# Altium schematic sheet Shema.SchDoc
size 420 x 297 mm; SheetTotal: 1
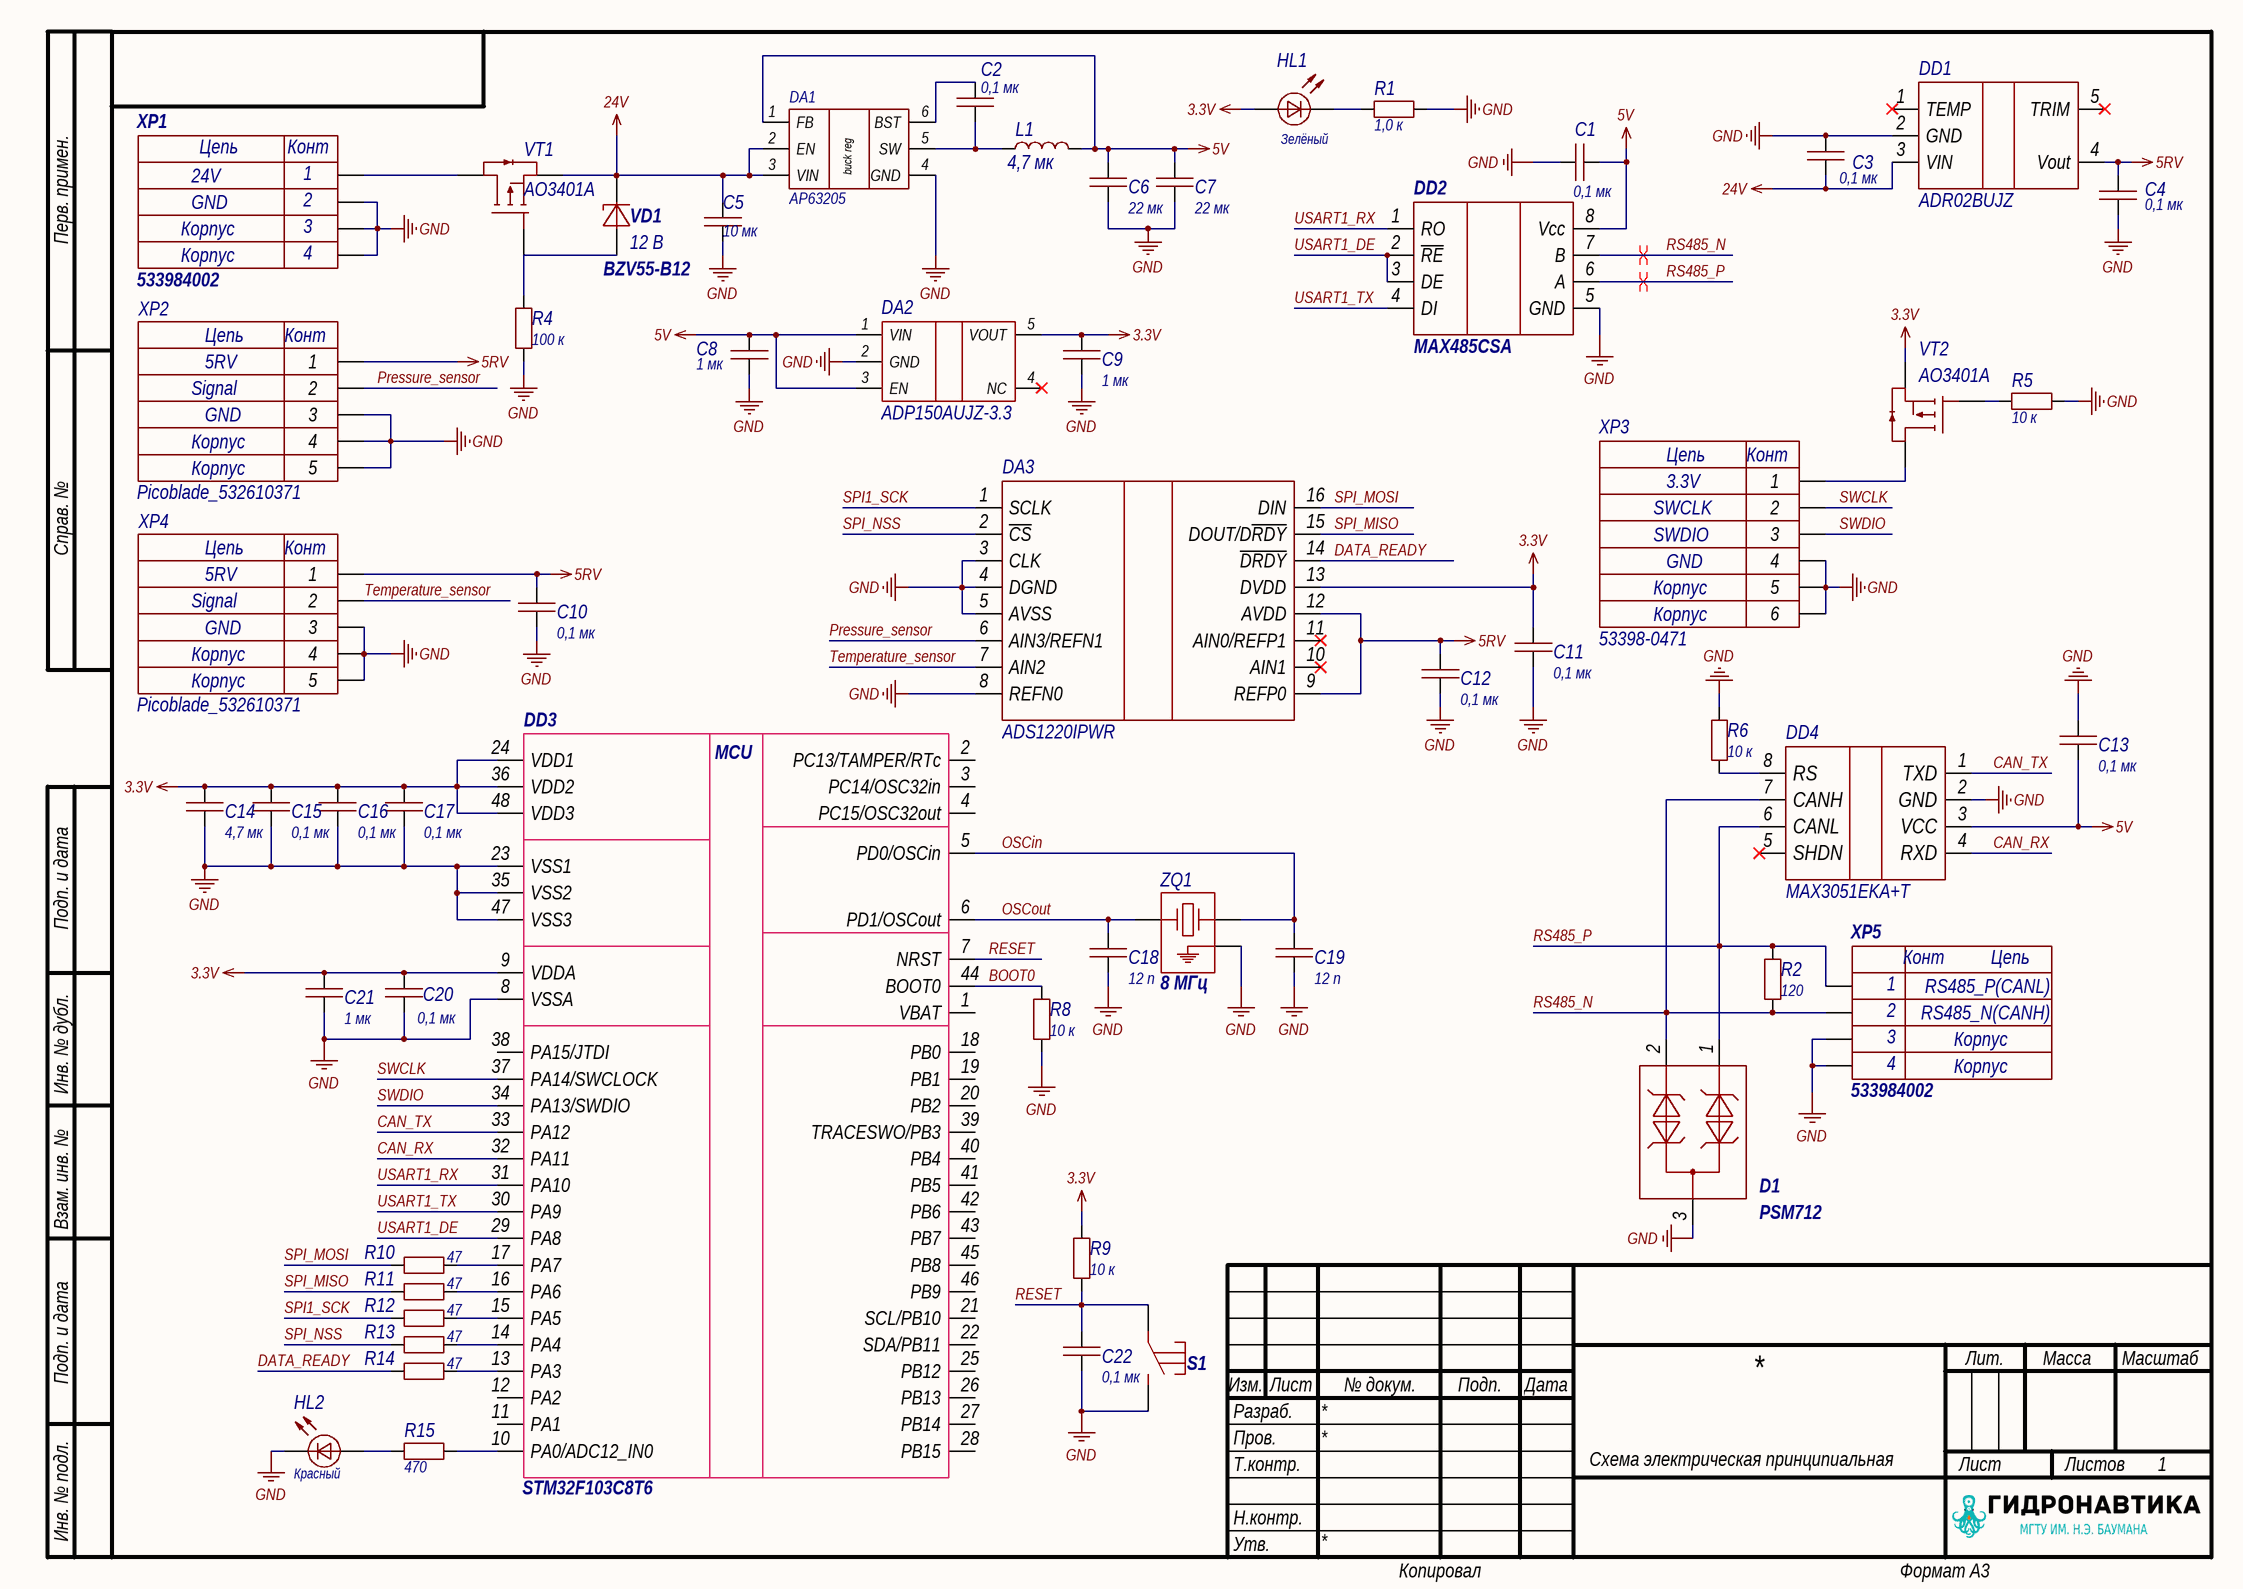
[diagram p0: Shema.SchDoc]

## Parts
C1  value 0,1 мк  [0603C]  (hidden comment: Capacitor)
C2  value 0,1 мк  [0603C]  (hidden comment: Capacitor)
C3  value 0,1 мк  [0603C]  (hidden comment: Capacitor)
C4  value 0,1 мк  [0603C]  (hidden comment: Capacitor)
C5  value 10 мк  [1210C]  (hidden comment: Capacitor)
C6  value 22 мк  [1210C]  (hidden comment: Capacitor)
C7  value 22 мк  [1210C]  (hidden comment: Capacitor)
C8  value 1 мк  [0603C]  (hidden comment: Capacitor)
C9  value 1 мк  [0603C]  (hidden comment: Capacitor)
C10  value 0,1 мк  [0603C]  (hidden comment: Capacitor)
C11  value 0,1 мк  [0603C]  (hidden comment: Capacitor)
C12  value 0,1 мк  [0603C]  (hidden comment: Capacitor)
C13  value 0,1 мк  [0603C]  (hidden comment: Capacitor)
C14  value 4,7 мк  [1206C]  (hidden comment: Capacitor)
C15  value 0,1 мк  [0603C]  (hidden comment: Capacitor)
C16  value 0,1 мк  [0603C]  (hidden comment: Capacitor)
C17  value 0,1 мк  [0603C]  (hidden comment: Capacitor)
C18  value 12 п  [0603C]  (hidden comment: Capacitor)
C19  value 12 п  [0603C]  (hidden comment: Capacitor)
C20  value 0,1 мк  [0603C]  (hidden comment: Capacitor)
C21  value 1 мк  [0603C]  (hidden comment: Capacitor)
C22  value 0,1 мк  [0603C]  (hidden comment: Capacitor)
D1  PSM712  [SOT23-3]
DA1  AP63205  [TSOT26]
DA2  ADP150AUJZ-3.3  [SOT23-5]
DA3  ADS1220IPWR  [TSSOP-16]
DD1  ADR02BUJZ  [SOT23-5]
DD2  MAX485CSA  [SOIC-8]
DD3  STM32F103C8T6  Value1: MCU  [LQFP48]
DD4  MAX3051EKA+T  [SOT-23-8]
HL1  value Зелёный  [0805D]  (hidden comment: LED)
HL2  value Красный  [0805D]  (hidden comment: LED)
L1  value 4,7 мк  [IHLP-2525]  (hidden comment: IHLP2525CZER4R7M01)
R1  value 1,0 к  [0603R]  (hidden comment: Resistor)
R2  value 120  [1206R]  (hidden comment: Resistor)
R4  value 100 к  [0603R]  (hidden comment: Resistor)
R5  value 10 к  [0603R]  (hidden comment: Resistor)
R6  value 10 к  [0603R]  (hidden comment: Resistor)
R8  value 10 к  [0603R]  (hidden comment: Resistor)
R9  value 10 к  [0603R]  (hidden comment: Resistor)
R10  value 47  [0603R]  (hidden comment: Resistor)
R11  value 47  [0603R]  (hidden comment: Resistor)
R12  value 47  [0603R]  (hidden comment: Resistor)
R13  value 47  [0603R]  (hidden comment: Resistor)
R14  value 47  [0603R]  (hidden comment: Resistor)
R15  value 470  [0603R]  (hidden comment: Resistor)
S1  Tact_button  [Button_SMD_10mm]  (value not drawn)
VD1  BZV55-B12  value 12 В  [mini_MELF_3.5mm]
VT1  AO3401A  [SOT23-3]
VT2  AO3401A  [SOT23-3]
XP1  533984002  Value3: Корпус  Value2: GND  Value1: 24V  [Picoblade_533984002]
XP2  Picoblade_532610371  Value5: Корпус  Value3: GND  Value2: Signal  Value1: 5RV  [CONN_532610001-SD_03_MOL]
XP3  53398-0471  Value6: Корпус  Value4: GND  Value3: SWDIO  Value2: SWCLK  Value1: 3.3V  [53398-0471]
XP4  Picoblade_532610371  Value5: Корпус  Value3: GND  Value2: Signal  Value1: 5RV  [CONN_532610001-SD_03_MOL]
XP5  533984002  Value3: Корпус  Value2: RS485_N(CANH)  Value1: RS485_P(CANL)  [Picoblade_533984002]
ZQ1  value 8 МГц  [QSMD3.2x2.5]  (hidden comment: XTAL_GND)

## Nets
3.3V: C9.2 C11.2 C14.2 C15.2 C16.2 C17.2 C20.2 C21.2 DA2.5(VOUT) DA3.13(DVDD) DD3.9(VDDA) DD3.24(VDD1) DD3.36(VDD2) DD3.48(VDD3) HL1.1 R9.1 VT2.2
5RV: C4.2 C10.2 C12.2 DA3.9(REFP0) DA3.12(AVDD) DD1.4(Vout) XP2.1 XP4.1
5V: C1.2 C6.2 C7.2 C8.2 C13.2 DA1.1(FB) DA2.1(VIN) DA2.3(EN) DD2.8(Vcc) DD4.3(VCC) L1.2
24V: C3.1 C5.2 DA1.2(EN) DA1.3(VIN) DD1.3(VIN) VD1.2 VT1.2
GND: C1.1 C3.2 C4.1 C5.1 C6.1 C7.1 C8.1 C9.1 C10.1 C11.1 C12.1 C13.1 C14.1 C15.1 C16.1 C17.1 C18.1 C19.1 C20.1 C21.1 C22.2 D1.3 DA1.4(GND) DA2.2(GND) DA3.3(CLK) DA3.4(DGND) DA3.5(AVSS) DA3.8(REFN0) DD1.2(GND) DD2.5(GND) DD3.8(VSSA) DD3.23(VSS1) DD3.35(VSS2) DD3.47(VSS3) DD4.2(GND) HL2.2 R1.2 R4.1 R5.2 R6.2 R8.2 S1.2 XP1.2 XP1.3 XP1.4 XP2.3 XP2.4 XP2.5 XP3.4 XP3.5 XP3.6 XP4.3 XP4.4 XP4.5 XP5.3 XP5.4 ZQ1.3
BOOT0: DD3.44(BOOT0) R8.1
CAN_RX: DD3.32(PA11) DD4.4(RXD)
CAN_TX: DD3.33(PA12) DD4.1(TXD)
DATA_READY: DA3.14(~{DRDY}) R14.1
OSCin: C19.2 DD3.5(PD0/OSCin) ZQ1.2
OSCout: C18.2 DD3.6(PD1/OSCout) ZQ1.1
Pressure_sensor: DA3.6(AIN3/REFN1) XP2.2
RESET: C22.1 DD3.7(NRST) R9.2 S1.1
RS485_N: D1.2 DD2.7(B) DD4.7(CANH) R2.1 XP5.2
RS485_P: D1.1 DD2.6(A) DD4.6(CANL) R2.2 XP5.1
SPI1_SCK: DA3.1(SCLK) R12.1
SPI_MISO: DA3.15(DOUT/D~{RDY}) R11.1
SPI_MOSI: DA3.16(DIN) R10.1
SPI_NSS: DA3.2(~{CS}) R13.1
SWCLK: DD3.37(PA14/SWCLOCK) XP3.2
SWDIO: DD3.34(PA13/SWDIO) XP3.3
Temperature_sensor: DA3.7(AIN2) XP4.2
USART1_DE: DD2.2(~{RE}) DD2.3(DE) DD3.29(PA8)
USART1_RX: DD2.1(RO) DD3.31(PA10)
USART1_TX: DD2.4(DI) DD3.30(PA9)
NetC2_1: C2.1 DA1.5(SW) L1.1
NetC2_2: C2.2 DA1.6(BST)
NetDD3_10: DD3.10(PA0/ADC12_IN0) R15.2
NetDD3_13: DD3.13(PA3) R14.2
NetDD3_14: DD3.14(PA4) R13.2
NetDD3_15: DD3.15(PA5) R12.2
NetDD3_16: DD3.16(PA6) R11.2
NetDD3_17: DD3.17(PA7) R10.2
NetDD4_8: DD4.8(RS) R6.1
NetHL1_2: HL1.2 R1.1
NetHL2_1: HL2.1 R15.1
NetR4_2: R4.2 VD1.1 VT1.1
NetR5_1: R5.1 VT2.1
NetVT1_3: VT1.3 XP1.1
NetVT2_3: VT2.3 XP3.1

Not connected (* = marked no-connect by the designer): DA2 4(NC)*; DA3 10(AIN1)* 11(AIN0/REFP1)*; DD1 1(TEMP)* 5(TRIM)*; DD3 1(VBAT) 2(PC13/TAMPER/RTc) 3(PC14/OSC32in) 4(PC15/OSC32out) 11(PA1) 12(PA2) 18(PB0) 19(PB1) 20(PB2) 21(SCL/PB10) 22(SDA/PB11) 25(PB12) 26(PB13) 27(PB14) 28(PB15) 38(PA15/JTDI) 39(TRACESWO/PB3) 40(PB4) 41(PB5) 42(PB6) 43(PB7) 45(PB8) 46(PB9); DD4 5(SHDN)*

## Layout directives
differential pair: RS485_N, RS485_P

## Notes on the sheet
- Перв. примен.
- Справ. №
- Подп. и дата
- Инв. № дубл.
- Взам. инв. №
- Разраб.
- Изм.
- Лист
- № докум.
- Подп.
- Дата
- Лит.
- Масса
- Масштаб
- Пров.
- Т.контр.
- Схема электрическая принципиальная
- Листов
- Инв. № подл.
- Утв.
- Н.контр.
- Копировал
- Формат А3
- (in symbol AP63205) buck reg
- (in symbol PicoBlade_53398-0471) Цепь; Конт
- (in symbol Picoblade_532610371) Цепь; Конт
- (in symbol Picoblade_533984002) Цепь; Конт

## Library data of the parts
C1-C4 C10-C13 C15-C17 C20 C22 = Capacitor_0,1u_10_50V_X7R_0603C: Конденсатор 0603C ёмкостью 0,1 мк 10%, 50 В, X7R; Voltage (V): 50; Capacity (nF): 100; Part Number: Capacitor_0,1u_10_50V_X7R_0603C; Tolerance: 10%; Dielectric: X7R
C5 = Capacitor_10u_10_35V_X7R_1210C: Конденсатор 1210C ёмкостью 10 мк 10%, 35 В, X7R; Voltage (V): 35; Capacity (nF): 10000; Part Number: Capacitor_10u_10_35V_X7R_1210C; Tolerance: 10%; Dielectric: X7R
C6 C7 = Capacitor_22u_10_25V_X7R_1210C: Конденсатор 1210C ёмкостью 22 мк 10%, 25 В, X7R; Voltage (V): 25; Capacity (nF): 22000; Part Number: Capacitor_22u_10_25V_X7R_1210C; Tolerance: 10%; Dielectric: X7R
C8 C9 C21 = Capacitor_1u_10_25V_X7R_0603C: Конденсатор 0603C ёмкостью 1 мк 10%, 25 В, X7R; Voltage (V): 25; Capacity (nF): 1000; Part Number: Capacitor_1u_10_25V_X7R_0603C; Tolerance: 10%; Dielectric: X7R
C14 = Capacitor_4,7u_10_50V_X7R_1206C: Конденсатор 1206C ёмкостью 4,7 мк 10%, 50 В, X7R; Voltage (V): 50; Capacity (nF): 4700; Part Number: Capacitor_4,7u_10_50V_X7R_1206C; Tolerance: 10%; Dielectric: X7R
C18 C19 = Capacitor_12p_5_50V_NP0_0603C: Конденсатор 0603C ёмкостью 12 п 5%, 50 В, NP0; Voltage (V): 50; Capacity (nF): 0,012; Автор: glebmih; Part Number: Capacitor_12p_5_50V_NP0_0603C; Tolerance: 5%; Dielectric: NP0
D1 = PSM712: Защитный диод для линии RS-485; Part Number: PSM712; Interface: RS-485
DA1 = AP63205: DC-DC понижающий преобразователь, Vin: 3.8 - 40 В; 5 В; 2 А; Автор: glebmih; Part Number: AP63205; Datasheet: https://static.chipdip.ru/lib/416/DOC012416105.pdf
DA2 = ADP150AUJZ-3.3: Стабилизатор напряжения 3.3В 150мА; Автор: glebmih; Part Number: ADP150AUJZ-3.3; Datasheet: https://static.chipdip.ru/lib/986/DOC003986581.pdf
DA3 = ADS1220IPWR: 24-Бит Sigma-Delta аналого-цифровой преобразователь; Автор: Vouka06; Part Number: ADS1220IPWR; Datasheet: Low-Power, Low-Noise, 24-Bit, ADC for Small-Signal Sensors (Rev. B)
DD1 = ADR02BUJZ: Источник опорного напряжения, 5В; Автор: Vouka05; Part Number: ADR02BUJZ; Datasheet: ADR01/ADR02/ADR03/ADR06 (Rev. S)
DD2 = MAX485CSA: RS-485 приёмопередатчик; Part Number: MAX485CSA
DD3 = STM32F103C8T6: Микроконтроллер; Manufacturer: ST Microelectronics; Rate: -0,3...4,0В; Shop: магазин с самой дешевой ценой; Notice: 48 пиновая версия STM32F103; Datasheet: http://www.st.com/content/ccc/resource/technical/document/datasheet/33/d4/6f/1d/df/0b/4c/6d/CD00161566.pdf/files/CD00161566.pdf/jcr:content/translations/en.CD00161566.pdf; Case: корпус; Part Number: STM32F103C8T6
DD4 = MAX3051EKA+T: CAN трансивер 1Mbps +3.3В; Автор: Vouka06; Part Number: MAX3051EKA+T; Datasheet: MAX3051 - +3.3V, 1Mbps, Low-Supply-Current CAN Transceiver
HL1 HL2 = LED: Светодиод; Part Number: LED
L1 = IHLP2525CZER4R7M01: ЧИП-индуктивность экранированная 4,7мкГн ±20% 5,5A 40мОм 2525; Inductance (μH): 4,7; Current: 5,5 А; Part Number: IHLP2525CZER4R7M01
R1 = Resistor_1.0k_1_0603: Резистор номиналом 1,0 кОм 1%; Power: *; Part Number: Resistor_1.0k_1_0603; Tolerance: 1%
R2 = Resistor_120_1_1206: Резистор номиналом 120 Ом 1%; Автор: glebmih; Power: *; Part Number: Resistor_120_1_1206; Tolerance: 1%
R4 = Resistor_100k_1_0603: Резистор номиналом 100 кОм 1%; Power: *; Part Number: Resistor_100k_1_0603; Tolerance: 1%
R5 R6 R8 R9 = Resistor_10k_1_0603: Резистор номиналом 10 кОм 1%; Power: *; Part Number: Resistor_10k_1_0603; Tolerance: 1%
R10-R14 = Resistor_47_1_0603: Резистор номиналом 47 Ом 1%; Power: *; Part Number: Resistor_47_1_0603; Tolerance: 1%
R15 = Resistor_470_1_0603: Резистор номиналом 470 Ом 1%; Power: *; Part Number: Resistor_470_1_0603; Tolerance: 1%
S1 = Tact_button: Тактовая кнопка; Part Number: Tact_button
VD1 = BZV55-B12: Стабилитрон 12В, 5%, 0.5Вт; Voltage (V): 12; Current: 5 мА; Power (W): 0.5; Accuracy: 0,02; Автор: rreali; Part Number: BZV55-B12
VT1 VT2 = AO3401A: P-канальный MOSFET; Part Number: AO3401A
XP1 XP5 = Picoblade_533984002: 2pin, 1.25mm, вилка, PicoBlade, на плату, SMT; System: Connector; Автор: rreali; Value4: Корпус; Part Number: Picoblade_533984002; Datasheet: https://www.molex.com/en-us/products/part-detail/533984002?display=pdf
XP2 XP4 = Picoblade_532610371: Picoblade 3-pin разъем; Автор: Vouka06; System: Connector; Value4: Корпус; Part Number: Picoblade_532610371
XP3 = PicoBlade_53398-0471: Разъем PicoBlade 1.25 мм, 4pin; System: Connector; Автор: Vouka06; Value5: Корпус; Part Number: PicoBlade_53398-0471; Datasheet: 53398-0471, Разъем PicoBlade 1.25 мм, 4pin, штыревой , на плату – купить оптом и в розницу
ZQ1 = XTAL_GND: Кварцевый резонатор с входом земли; Part Number: XTAL_GND